# EAGLE design badge (EAGLE 9.6.2)
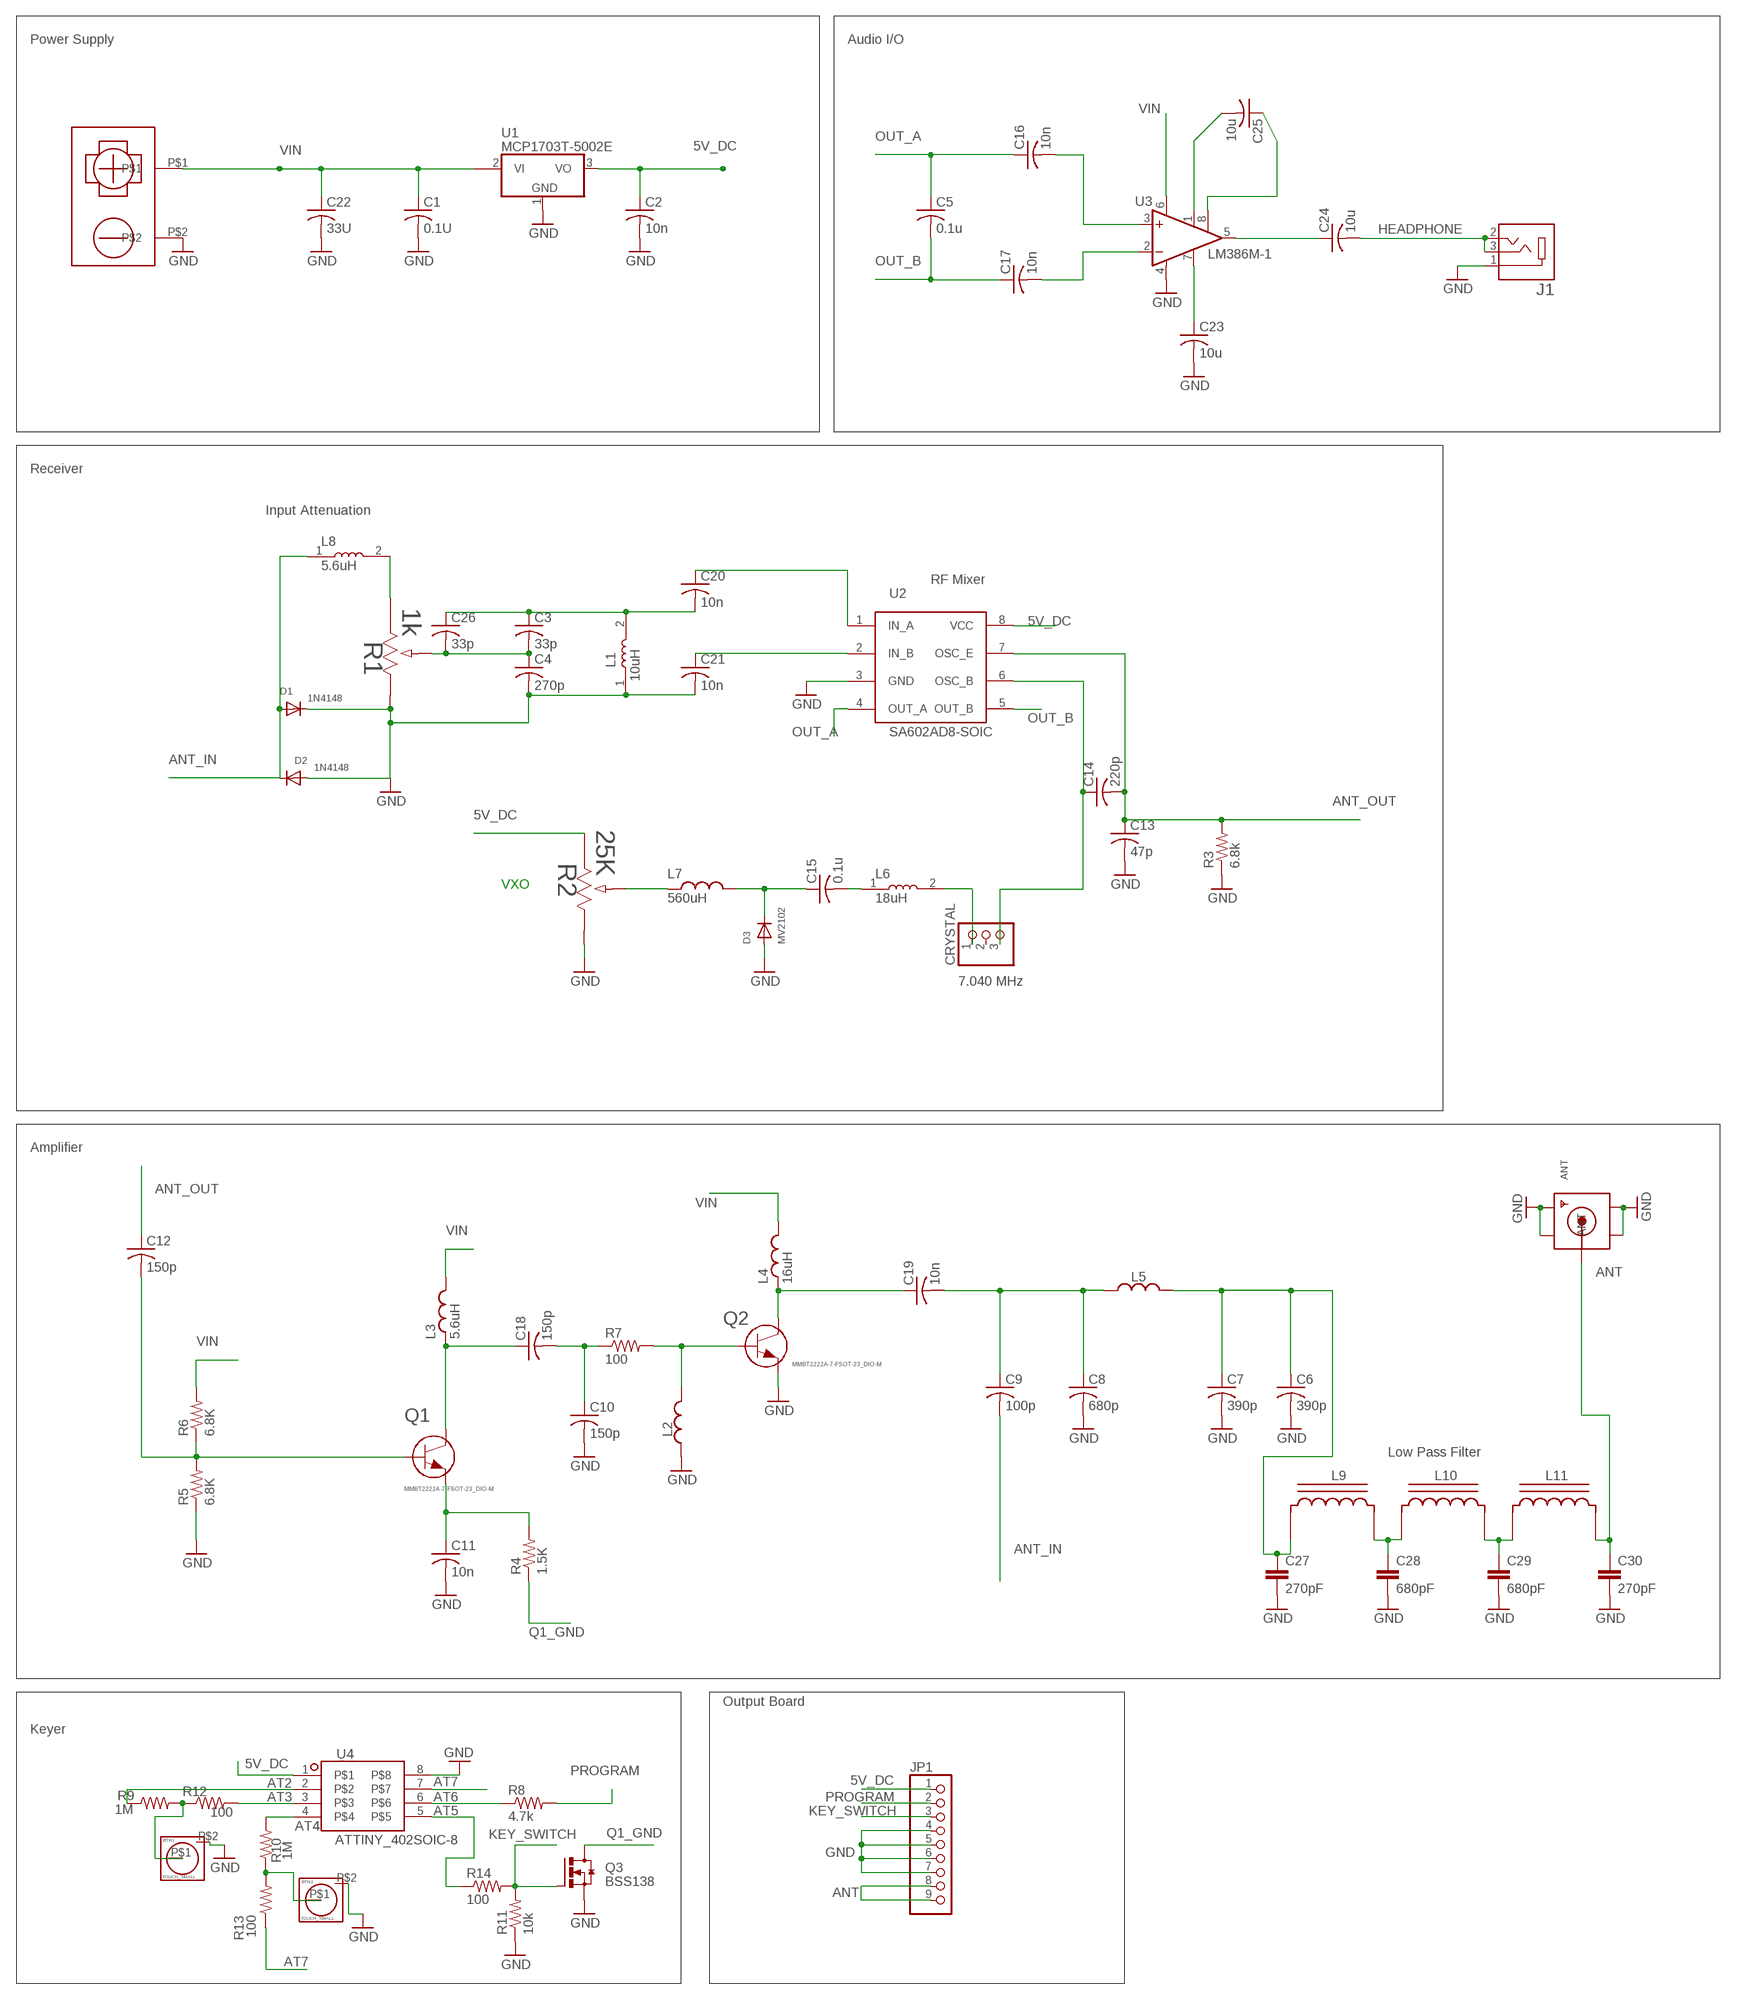
[diagram p0: schematic, sheet 1]

## Parts
ANT  SMACONNECTOR_EDGE  [SMA_EDGELAUNCH]
BTN1  TOUCH_SMALL  [TOUCH_SMALL]
BTN2  TOUCH_SMALL  [TOUCH_SMALL]
C1  0.1U  C-USC0805  [C0805]
C2  10n  C-USC0805  [C0805]
C3  33p  C-USC0805  [C0805]
C4  270p  C-USC0805  [C0805]
C5  0.1u  C-USC0805  [C0805]
C6  390p  C-USC0805  [C0805]
C7  390p  C-USC0805  [C0805]
C8  680p  C-USC0805  [C0805]
C9  100p  C-USC0805  [C0805]
C10  150p  C-USC0805  [C0805]
C11  10n  C-USC0805  [C0805]
C12  150p  C-USC0805  [C0805]
C13  47p  C-USC0805  [C0805]
C14  220p  C-USC0805  [C0805]
C15  0.1u  C-USC0805  [C0805]
C16  10n  C-USC0805  [C0805]
C17  10n  C-USC0805  [C0805]
C18  150p  C-USC0805  [C0805]
C19  10n  C-USC1206  [C1206]
C20  10n  C-USC0805  [C0805]
C21  10n  C-USC0805  [C0805]
C22  33U  C-USC1206  [C1206]
C23  10u  C-USC0805  [C0805]
C24  10u  C-USC0805  [C0805]
C25  10u  C-USC0805  [C0805]
C26  33p  C-USC0805  [C0805]
C27  270pF  1.0UF-1206-50V-10%  [1206]
C28  680pF  1.0UF-1206-50V-10%  [1206]
C29  680pF  1.0UF-1206-50V-10%  [1206]
C30  270pF  1.0UF-1206-50V-10%  [1206]
CRYSTAL  PINHD-1X3  [1X03]
D1  1N4148  DIODE_SOD-123FL  [SOD-123FL]
D2  1N4148  DIODE_SOD-123FL  [SOD-123FL]
D3  MV2102  DIODESOD-323F  [SOD-323F]
J1  SJ-3523-SMT-TR  [CUI_SJ-3523-SMT-TR]
JP1  PINHD-1X9  [1X09-BIG]
L1  10uH  MLF2012E5R6KT000  [INDC2012X87N]
L2  L_CHIP-1008(2520-METRIC)  [INDC2520X120N]
L3  5.6uH  SRP3012C-5R6M  [SRP3012C]
L4  16uH  ASPI-0630LR  [ASPI-0630LR]
L5  1.2uH  SRN4018TA-1R2M  [SRN4018TA]
L6  18uH  MLF2012E5R6KT000  [INDC2012X87N]
L7  560uH  LMOLDED-1812(4532-METRIC)  [INDM4532X32_W]
L8  5.6uH  MLF2012E5R6KT000  [INDC2012X87N]
L9  1.38uH  T37_INDUCTOR  [T37_INDUCTOR]
L10  1.67uH  T37_INDUCTOR  [T37_INDUCTOR]
L11  1.38uH  T37_INDUCTOR  [T37_INDUCTOR]
Q1  MMBT2222A-7-FSOT-23_DIO-M  [SOT-23_DIO-M]
Q2  MMBT2222A-7-FSOT-23_DIO-M  [SOT-23_DIO-M]
Q3  BSS138  [SOT23-3]
R1  1k  3362W-1-102LF  [POT_3362W]
R2  25K  3362W-1-102LF  [POT_3362W]
R3  6.8k  R-US_M0805  [M0805]
R4  1.5K  R-US_M0805  [M0805]
R5  6.8K  R-US_M0805  [M0805]
R6  6.8K  R-US_M0805  [M0805]
R7  100  R-US_M0805  [M0805]
R8  4.7k  R-US_M0805  [M0805]
R9  1M  R-US_M0805  [M0805]
R10  1M  R-US_M0805  [M0805]
R11  10k  R-US_M0805  [M0805]
R12  100  R-US_M0805  [M0805]
R13  100  R-US_M0805  [M0805]
R14  100  R-US_M0805  [M0805]
U1  MCP1703T-5002E  MCP170312MB  [SOT89]
U2  SA602AD8-SOIC  [SOIC127P599X175-8N]
U3  LM386M-1  [SO08]
U4  ATTINY_402SOIC-8  [SOIC127P599X175-8N]
U$1  9V_9689V_968_SMD  [9V_968_PAD]

## Nets
5V_DC [power]: C2.1 JP1.1 R2.1 U1.3(VO) U2.8(VCC) U4.1
ANT [power]: ANT.P(ANT) C30.1 JP1.8 JP1.9 L11.CA
ANT_IN: C9.2 D1.A D2.C L8.1
ANT_OUT: C12.1 C13.1 C14.2 R3.2 U2.7(OSC_E)
AT2: R9.1 U4.2
AT3: R12.2 U4.3
AT4: R10.2 U4.4
AT5: R14.1 U4.5
AT6: R8.1 U4.6
AT7: R13.1 U4.7
GND: ANT.GND@1(GND4) ANT.GND@3(GND2) BTN1.P$2 BTN2.P$2 C1.2 C2.2 C4.2 C6.2 C7.2 C8.2 C10.2 C11.2 C13.2 C21.2 C22.2 C23.2 C27.2 C28.2 C29.2 C30.2 D1.C D2.A D3.A J1.1 JP1.4 JP1.5 JP1.6 JP1.7 L1.1 L2.1 Q3.2(S) R1.3 R2.3 R3.1 R5.1 R11.1 U1.1(GND) U2.3(GND) U3.4(GND) U4.8 U$1.P$2
HEADPHONE: C24.2 J1.2 J1.3
KEY_SWITCH: JP1.3 Q3.1(G) R11.2 R14.2
N$1: ANT.GND@2(GND3)
N$2: ANT.GND@4(GND1)
N$3: C20.1 U2.1(IN_A)
N$4: C21.1 U2.2(IN_B)
N$5: C3.1 C20.2 C26.1 L1.2
N$6: C3.2 C4.1 C26.2 R1.2
N$7: L8.2 R1.1
N$8: C14.1 CRYSTAL.3 U2.6(OSC_B)
N$9: C16.2 U3.3(+IN)
N$10: C17.2 U3.2(-IN)
N$11: C23.1 U3.7(BYPASS)
N$12: C25.1 U3.8(GAIN)
N$13: C25.2 U3.1(GAIN)
N$14: C24.1 U3.5(OUT)
N$15: CRYSTAL.1 L6.2
N$16: C15.2 L6.1
N$17: C15.1 D3.C L7.2
N$18: L7.1 R2.2
N$19 [power]: C12.2 Q1.1 R5.2 R6.1
N$20 [power]: C11.1 Q1.2 R4.2
N$21 [power]: C18.1 L3.P$1 Q1.3
N$22 [power]: C10.1 C18.2 R7.1
N$23 [power]: L2.2 Q2.1 R7.2
N$24 [power]: C19.1 L4.P$1 Q2.3
N$25 [power]: C8.1 C9.1 C19.2 L5.P$1
N$26 [power]: C6.1 C7.1 C27.1 L5.P$2 L9.CB
N$27: BTN1.P$1 R9.2 R12.1
N$28 [power]: C28.1 L9.CA L10.CB
N$29 [power]: Q2.2 ; supply symbol labelled GND
N$30 [power]: C29.1 L10.CA L11.CB
N$31: BTN2.P$1 R10.1 R13.2
OUT_A: C5.1 C16.1 U2.4(OUT_A)
OUT_B: C5.2 C17.1 U2.5(OUT_B)
PROGRAM: JP1.2 R8.2
Q1_GND: Q3.3(D) R4.1
VIN [power]: C1.1 C22.1 L3.P$2 L4.P$2 R6.2 U1.2@1(VI1) U3.6(VS) U$1.P$1
Unconnected: CRYSTAL.2 U1.2(VI)

## Notes on the sheet
- Power Supply | Audio I/O
- Receiver
- Input Attenuation
- RF Mixer
- VXO
- 7.040 MHz
- Amplifier
- Low Pass Filter
- Output Board
- Keyer

## Library data of the parts
ANT = zort2:SMACONNECTOR: SMA Connector 90° DIP SMA Connector, 50 Ohm (4UConnector: 07259)
BTN1 BTN2 = zort2:TOUCH_SMALL: 10mm capacitive touch pad With ground hatch on top and bottom
C1-C26 = adafruit:C-US: CAPACITOR, American symbol
C27-C30 = SparkFun-Capacitors:1.0UF: 1µF ceramic capacitors A capacitor is a passive two-terminal electrical component used to store electrical energy temporarily in an electric field.; PROD_ID: CAP-09822; VALUE: 1.0uF
CRYSTAL = adafruit:PINHD-1X3: PIN HEADER
D1-D3 = adafruit:DIODE: Diode SMADIODE - SMA Surface Mount Package 20V 1A Schottky Diode Digikey: 641-1014-6-ND DO-1N4148 - Through Hole Small Current Diode SOD-123 20V 1 A (.5mV Vf) Schottky Diode - Digikey: MBRX120TPMSCT-ND SOD-323 10V 570mA (.38mV Vf, 3ns) Schottky Diode - Digikey: ZLLS410CT-ND SOD-523 30V 30mA Schottky Diode (RB751S-40TE61) - Digikey: RB751S-40TE61CT-ND SOT23-R/W - SOT23 Package (R = Solder Paste/Reflow Ovens, W = Hand-Soldering) BAT54Film 40V 300mA - Digikey: 497-7162-1-ND
J1 = SJ-3523-SMT-TR:SJ-3523-SMT-TR: Audio Jack Connector 3.5 mm Low Profile Surface Mount Stereo Jack, 3 Pin Right-Angle; MF: CUI Inc; STANDARD: Manufacturer recommendations
JP1 = adafruit:PINHD-1X9: Pin header 1x10 0.1" spacing With round pins
L1 L6 L8 = MLF2012E5R6KT000:MLF2012E5R6KT000: MLF Series 0805 5.6 uH ±10 % Tol. 15 mA Magnetic Shielded Multilayer Inductor; DESCRIPTION: Inductor RF Chip Shielded Multi-Layer 5.6uH 10% 4MHz 50Q-Factor Ferrite 15mA 600mOhm DCR 0805 T/R; MF: TDK; MP: MLF2012E5R6KT000; PACKAGE: 0805 TDK
L2 = zort2:L: Inductor Fixed - Generic; CATEGORY: Inductor; SUB-CATEGORY: Fixed
L3 = zort2:SRP3012C-5R6M: SRP3012C-5R6M SMD 1.5A 15uH inductor with a flat square package. DigiKey Link <https://www.digikey.com/en/products/detail/bourns-inc/SRP3012C-5R6M/11633310>.
L4 = zort2:ASPI-0630LR: ASPI-0630LR SMD inductors with flat square cases DigiKey Link <https://www.digikey.com/en/products/detail/abracon-llc/ASPI-0630LR-150M-T15/3059603>
L5 = zort2:SRN4018TA-1R2M: SRN4018TA-1R2M 1.2uH 3A inductor
L7 = zort2:L: Inductor Fixed - Generic
L9-L11 = toroid:T37_INDUCTOR: Inductor wound on a T37 Toroid
Q1 Q2 = zort2:MMBT2222A-7-F; BUILT_BY: EMA_UL_Team; MANUFACTURER_PART_NUMBER: MMBT2222A-7-F; SOURCELIBRARY: DIODESINC_2_2015-08-18; VENDOR: Diodes Inc
Q3 = Transistor:BSS138: MOSFET N-CH 50V 220MA SOT-23 Manufacturer's datasheet <https://www.onsemi.com/pub/Collateral/BSS138-D.PDF>; CREATED_BY: PCBLayout.com; DIGIKEY_PART_NUMBER: BSS138CT-ND; MANUFACTURER: ON Semiconductor; MPN: BSS138; PACKAGE: SOT-23
R1 R2 = zort2:3362W-1-102LF; BUILT_BY: EMA_UL_Team; MANUFACTURER_PART_NUMBER: 3362W-1-102LF; SOURCELIBRARY: Bourns_2012-08-08; VENDOR: Bourns Electronics
R3-R14 = adafruit:R-US_: RESISTOR, American symbol
U1 = linear:MCP1703*: 250 mA, 16V, Low Quiescent Current LDO Regulator Source: http://ww1.microchip.com/downloads/en/DeviceDoc/22049b.pdf
U2 = zort2:SA602AD
U3 = linear:LM386?-*: Low Voltage Audio Power Amplifier Source: http://cache.national.com/ds/LM/LM386.pdf
U4 = zort2:ATTINY_402
U$1 = zort2:9V_968: Keystone 968, 9V connector pad. https://www.digikey.com/product-detail/en/keystone-electronics/968/36-968-ND/151577

## Net classes
1 power: width 0.305 mm

## Board
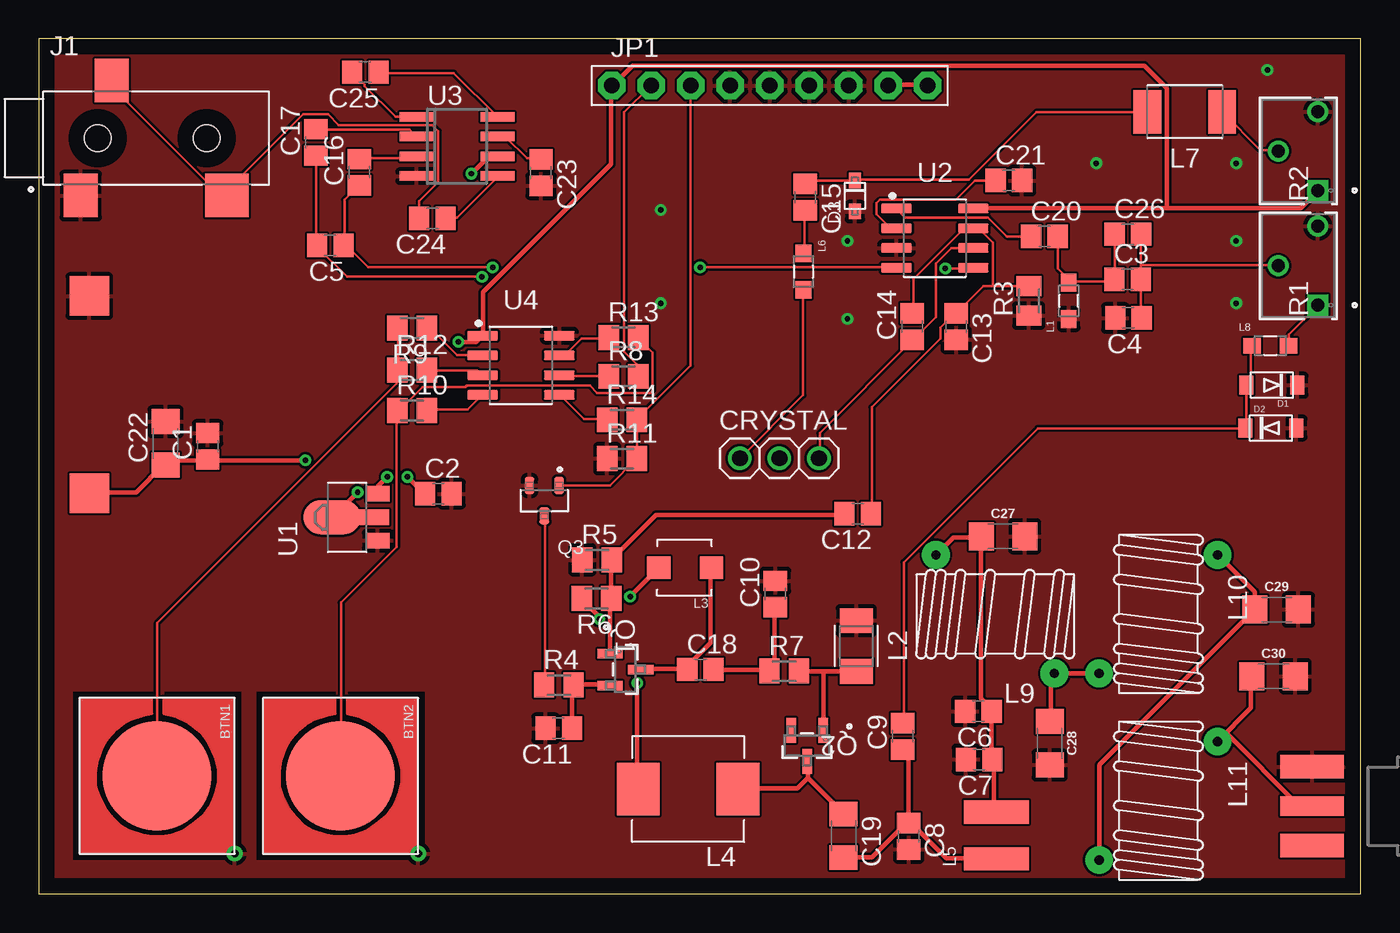
[diagram p1: board, top side]
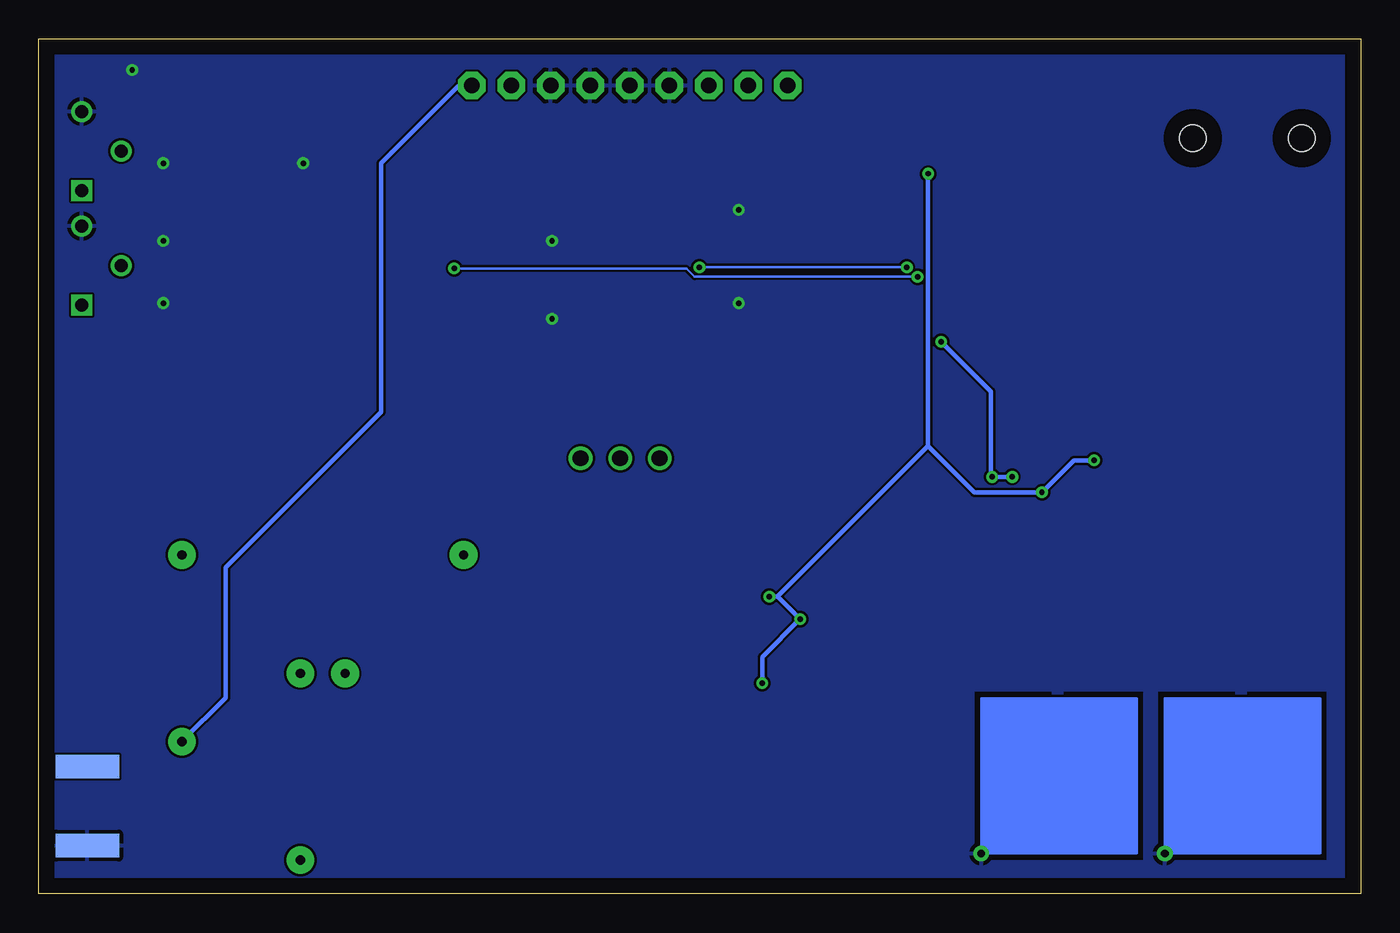
[diagram p2: board, bottom side, seen from below]

Size 85 x 55 mm. Coordinates in mm from the lower left corner, seen from the top.
Outline: 0,0 85,0 85,55 0,55 0,0
Copper layers (1*16): Top 0.035mm / dielectric 1.5mm / Bottom 0.035mm
Design rules "default": minimum track width 6mil, minimum drill 0.35mm, track to track 6mil, track to pad 6mil, pad to pad 6mil, via to via 6mil, smd to smd 6mil, copper to edge 40mil, drill to drill 6mil, minimum pad ring 10mil, minimum via ring 8mil, stop-mask expansion 4mil, vias tented up to drill 0mil, thermal gap 10mil

### Footprints (pad centres in the part's own frame; a part is rotated, then mirrored left to right if it is on the bottom)
SMA_EDGELAUNCH = smd 4.064 x 1.524: GND@1 2.032,-2.54; GND@2 2.032,2.54 | smd 4.064 x 1.524 bottom: GND@3 2.032,2.54; GND@4 2.032,-2.54 | smd 4.064 x 1.27: P 2.032,0
TOUCH_SMALL = smd 7 x 7: P$1 0,0 | drill 0.5 pad 1.016: P$2 5,5
C0805 = smd 1.3 x 1.5: 1 -0.85,0; 2 0.85,0
C1206 = smd 1.6 x 1.8: 1 -1.4,0; 2 1.4,0
1206 = smd 1.6 x 1.8: 1 -1.4,0; 2 1.4,0
1X03 = drill 1.016: 1 -2.54,0; 2 0,0; 3 2.54,0
SOD-123FL = smd 0.91 x 1.22: A 1.637,0; C -1.637,0
SOD-323F = smd 1 x 0.8: A -1,0; C 1,0
CUI_SJ-3523-SMT-TR = smd 2.2 x 2.8: 1 -1.1,-3.7; 3 0.9,3.7 | smd 2.8 x 2.8: 2 8.3,-3.7 | hole 1.7: 0,0; 7,0
1X09-BIG = drill 1.016 pad 1.778 octagon: 1 -10.16,0; 2 -7.62,0; 3 -5.08,0; 4 -2.54,0; 5 0,0; 6 2.54,0; 7 5.08,0; 8 7.62,0; 9 10.16,0
INDC2012X87N = smd 1.15 x 1: 1 -1.175,0; 2 1.175,0
INDC2520X120N = smd 1.587 x 2.129: 1 -1.633,0; 2 1.633,0
SRP3012C = smd 1.5 x 1.45: P$1 -1.7,0; P$2 1.7,0
ASPI-0630LR = smd 2.75 x 3.4: P$1 -3.2,0; P$2 3.2,0
SRN4018TA = smd 1.5 x 4.2: P$1 -1.5,0; P$2 1.5,0
INDM4532X32_W = smd 1.793 x 2.799: 1 -2.4,0; 2 2.4,0
T37_INDUCTOR = drill 0.6 pad 1.778: CA -3.81,-3.81; CB 3.81,3.81
SOT-23_DIO-M = smd 0.612 x 1.626: 1 -1.025,-0.996; 2 1.025,-0.996; 3 0,0.996
SOT23-3 = smd 0.62 x 1.1: 1 -0.95,-0.975; 2 0.95,-0.975; 3 0,0.975
POT_3362W = drill 0.838 pad 1.346 square: 1 0,0 | drill 0.838 pad 1.346: 2 2.54,2.54; 3 5.08,0
M0805 = smd 1.3 x 1.6: 1 -0.95,0; 2 0.95,0
SOT89 = smd 1 x 1.5: 1 -1.499,-1.981; 3 1.499,-1.981 | smd 1 x 2: 2 0,-1.727 | smd 2.2 x 3.7: 2@1 0,0.94
SOIC127P599X175-8N = smd 1.965 x 0.602: 1 -2.47,1.905; 2 -2.47,0.635; 3 -2.47,-0.635; 4 -2.47,-1.905; 5 2.47,-1.905; 6 2.47,-0.635; 7 2.47,0.635; 8 2.47,1.905
SO08 = smd 0.6 x 2.2: 1 -1.905,-2.6; 2 -0.635,-2.6; 3 0.635,-2.6; 4 1.905,-2.6; 5 1.905,2.6; 6 0.635,2.6; 7 -0.635,2.6; 8 -1.905,2.6
9V_968_PAD = smd 2.54 x 2.54: P$1 0,6.35; P$2 0,-6.35

### Placement (x,y rotation side)
ANT  83.91,5.65 180 top
BTN1  7.6,7.6 270 top
BTN2  19.4,7.6 270 top
C1  10.86,28.79 90 top
C2  25.69,25.74 0 top
C3  70.01,39.54 0 top
C4  70.07,37.05 180 top
C5  18.74,41.71 180 top
C6  60.42,11.75 180 top
C7  60.47,8.65 180 top
C8  55.94,3.71 270 top
C9  55.56,10.14 90 top
C10  47.36,19.29 90 top
C11  33.43,10.66 180 top
C12  52.66,24.46 180 top
C13  58.99,36.5 270 top
C14  56.16,36.49 90 top
C15  49.29,44.82 270 top
C16  20.61,46.42 90 top
C17  17.81,48.34 90 top
C18  42.54,14.44 0 top
C19  51.75,3.74 270 top
C20  64.66,42.29 0 top
C21  62.38,45.89 0 top
C22  8.15,28.98 90 top
C23  32.29,46.4 270 top
C24  25.31,43.46 180 top
C25  20.99,52.86 180 top
C26  70.03,42.44 0 top
C27  62,23 0 top
C28  65,9.7 270 top
C29  79.6,18.3 0 top
C30  79.4,14 0 top
CRYSTAL  47.62,28.02 0 top
D1  79.29,32.73 180 top
D2  79.23,29.97 0 top
D3  52.48,44.9 90 top
J1  3.79,48.62 0 top
JP1  47,52 0 top
L1  66.23,38.15 90 top
L2  52.57,15.95 270 top
L3  41.56,20.98 180 top
L4  41.75,6.75 180 top
L5  61.58,3.76 90 top
L6  49.17,40.03 270 top
L7  73.69,50.31 180 top
L8  79.19,35.27 0 top
L9  61.5,18 90 top
L10  72,18 180 top
L11  72,6 180 top
Q1  37.72,14.44 270 top
Q2  49.4,9.53 180 top
Q3  32.5,25.3 180 top
R1  82.25,37.87 90 top
R2  82.25,45.25 90 top
R3  63.66,38.15 90 top
R4  33.44,13.44 0 top
R5  35.89,21.49 0 top
R6  35.86,19.01 180 top
R7  47.93,14.34 0 top
R8  37.6,33.3 0 top
R9  24,36.4 180 top
R10  24,31.1 0 top
R11  37.5,28 0 top
R12  24,33.7 0 top
R13  37.6,35.8 0 top
R14  37.5,30.5 0 top
U1  19.81,24.23 90 top
U2  57.62,42.19 0 top
U3  26.89,48.08 270 top
U4  31,34 0 top
U$1  3.24,32.11 180 top

### Tracks (layer width: path | path; a pad name or v marks a point on that pad's centre or on a via)
5V_DC  (via drill 0.35)
  Top 0.305: 72.54,44.12 81.15,44.12 82.22,45.19 R2.1 | 72.54,44.12 60.12,44.12 U2.8 | v22.4,26.82 21.79,26.21 21.79,25.76 U1.3 | v23.7,26.82 24.77,25.76 C2.1 | v26.98,35.51 28.12,35.51 28.42,35.81 U4.1 28.57,35.97 28.57,38.71 36.8,46.94 36.8,51.97 JP1.1 36.96,52.05 38.18,53.26 71.09,53.26 72.54,51.82 72.54,44.12
  Bottom 0.305: v22.4,26.82 v23.7,26.82 23.77,26.9 23.77,32.31 v26.98,35.51
ANT
  Top 0.305: JP1.8 54.63,52.05 57.15,52.05 JP1.9 | C30.1 77.95,13.95 77.95,11.96 75.82,9.83 L11.CA 76.43,10.29 81,5.71 81.84,5.71 ANT.P
  Bottom 0.305: JP1.9 57.23,51.97 58.03,51.97 63,47 63,31 73,21 73,12.62 L11.CA 75.74,9.83
ANT_IN
  Top 0.152: L8.1 77.95,35.2 77.95,32.99 77.72,32.77 D1.A 77.65,32.69 77.65,30.02 D2.C 77.57,29.95 64.24,29.95 55.63,21.34 55.63,11.05 C9.2
ANT_OUT
  Top 0.152: C14.2 56.24,37.41 56.24,39.55 59.51,42.82 60.05,42.82 U2.7 60.12,42.82 60.43,42.82 61.34,41.91 61.34,39.09 | C12.1 53.57,24.46 53.57,31.32 57.99,35.74 57.99,36.42 58.98,37.41 C13.1 59.05,37.41 60.73,39.09 61.34,39.09 | 61.34,39.09 63.63,39.09 R3.2
AT2
  Top 0.152: R9.1 24.99,36.35 25.22,36.35 26.9,34.67 28.5,34.67 U4.2
AT3
  Top 0.152: R12.2 24.99,33.68 28.19,33.68 28.5,33.38 U4.3
AT4
  Top 0.152: R10.2 24.99,31.17 27.58,31.17 28.5,32.08 U4.4
AT5
  Top 0.152: R14.1 36.5,30.56 35.05,30.56 33.53,32.08 U4.5
AT6
  Top 0.152: R8.1 36.58,33.3 33.53,33.3 U4.6
AT7
  Top 0.152: R13.1 36.58,35.74 34.9,35.74 33.83,34.67 33.53,34.67 U4.7
GND  (via drill 0.35)
  other vias: 52,42 52,37 40,44 40,38 79,53 77,47 77,42 77,38 68,47
  pour Top: 0.3,54.7 0.3,0.3 84.7,0.3 84.7,54.7
  pour Bottom: 0.3,54.6 0.3,0.3 84.7,0.3 84.7,54.7 0.3,54.7
HEADPHONE
  Top 0.152: C24.2 24.46,43.51 24.46,44.58 25.68,45.8 25.68,49.07 25.3,49.45 19.28,49.45 18.59,50.14 16.99,50.14 12.12,45.26 12.12,44.96 J1.2 12.12,45.34 11.28,45.34 4.72,51.89 4.72,52.27 J1.3
KEY_SWITCH
  Top 0.152: Q3.1 36.73,26.29 38.41,27.96 R11.2 38.48,28.04 38.48,30.48 R14.2 38.48,30.56 41.91,33.98 41.91,51.97 JP1.3
N$3
  Top 0.152: C20.1 63.78,42.29 62.26,42.29 61.04,43.51 55.7,43.51 55.17,44.04 U2.1
N$4
  Top 0.152: C21.1 61.49,45.87 60.2,45.87 58.98,44.65 54.1,44.65 53.87,44.42 53.87,43.74 54.71,42.9 55.09,42.9 U2.2
N$5
  Top 0.152: C20.2 65.53,42.22 65.53,40.23 66.29,39.47 L1.2 66.29,39.4 69.04,39.4 69.11,39.47 C3.1 69.19,39.55 69.19,42.37 C26.1
N$6
  Top 0.152: C4.1 70.87,37.11 70.87,39.47 C3.2 70.87,40.46 | 70.87,40.46 70.87,42.37 C26.2 | 70.87,40.46 79.7,40.46 R1.2
N$7
  Top 0.152: L8.2 80.39,35.28 80.39,35.97 82.22,37.8 R1.1
N$8
  Top 0.152: U2.6 60.05,41.53 58.67,41.53 57.68,40.54 57.68,37.11 56.24,35.66 C14.1 56.16,35.59 50.22,29.64 50.22,28.04 CRYSTAL.3
N$9
  Top 0.152: C16.2 20.65,47.32 24.16,47.32 24.23,47.4 U3.3
N$10
  Top 0.152: C17.2 17.83,49.15 23.85,49.15 24.23,48.77 U3.2
N$11
  Top 0.152: C23.1 32.23,47.32 31.39,47.32 30.02,48.69 29.57,48.69 U3.7
N$12
  Top 0.152: C25.1 21.87,52.81 26.67,52.81 U3.8
N$13
  Top 0.152: C25.2 20.19,52.81 20.95,52.05 20.95,51.97 22.94,49.99 24.23,49.99 U3.1
N$14
  Top 0.152: C24.1 26.21,43.51 26.9,43.51 29.49,46.1 U3.5
N$15
  Top 0.152: L6.2 49.15,38.79 49.15,32.08 45.11,28.04 CRYSTAL.1
N$16
  Top 0.152: L6.1 49.23,41.22 49.23,43.97 C15.2
N$17
  Top 0.152: C15.1 49.3,45.72 49.45,45.87 52.43,45.87 D3.C 52.5,45.95 59.82,45.95 64.16,50.29 71.25,50.29 L7.2
N$18
  Top 0.152: R2.2 79.7,47.85 78.56,47.85 76.12,50.29 L7.1
N$19
  Top 0.305: C12.2 51.74,24.38 39.7,24.38 36.88,21.57 R5.2 36.8,21.34 36.8,19.05 R6.1 36.73,18.9 Q1.1
N$20
  Top 0.305: C11.1 34.29,13.34 34.37,13.41 R4.2 34.52,13.49 36.65,13.49 Q1.2
N$21
  Top 0.305: Q1.3 38.79,14.48 41.68,14.48 C18.1 41.68,14.63 43.2,16.15 43.2,20.95 L3.P$1
N$22
  Top 0.305: C18.2 43.43,14.4 46.94,14.4 R7.1 46.94,14.55 47.32,14.94 47.32,18.36 C10.1
N$23
  Top 0.305: 50.44,14.33 52.5,14.33 L2.2 | 50.44,14.33 48.92,14.33 R7.2 | 50.44,14.33 50.44,10.59 Q2.1
N$24
  Top 0.305: 49.45,7.47 49.45,8.46 Q2.3 | 49.45,7.47 51.74,5.18 C19.1 | 49.45,7.47 48.77,6.78 44.96,6.78 L4.P$1
N$25
  Top 0.305: C8.1 55.93,4.57 55.93,8.91 55.63,9.22 C9.1 | C19.2 51.82,2.36 53.57,2.36 55.78,4.57 C8.1 | L5.P$1 61.57,2.29 58.37,2.29 56.08,4.57 C8.1
N$26
  Top 0.305: L9.CB 57.76,21.87 58.83,22.94 60.58,22.94 C27.1 60.58,22.78 60.58,12.57 61.27,11.89 C6.1 61.27,11.73 61.27,8.69 C7.1 61.42,8.53 61.42,5.49 61.57,5.33 L5.P$2
N$27
  Top 0.152: R9.2 23.09,36.35 23.09,33.76 R12.1 23.01,33.68 23.01,32.84 7.62,17.45 7.62,7.62 BTN1.P$1
N$28
  Top 0.305: C28.1 65.08,11.12 65.08,13.95 65.3,14.17 L9.CA 65.46,14.17 68.12,14.17 L10.CB
N$30
  Top 0.305: L10.CA 75.82,21.79 78.18,19.43 78.18,18.36 C29.1 78.11,18.21 68.2,8.31 68.2,2.21 L11.CB
N$31
  Top 0.152: R13.2 38.56,35.74 39.47,34.82 39.47,32.38 39.32,32.23 35.89,32.23 35.43,32.69 27.51,32.69 27.43,32.61 24.69,32.61 23.24,31.17 23.09,31.17 R10.1 23.01,31.09 23.01,22.33 19.43,18.75 19.43,7.62 BTN2.P$1
OUT_A  (via drill 0.35)
  Top 0.152: C16.1 20.57,45.57 19.66,44.65 19.66,41.76 C5.1 19.74,41.76 21.18,40.31 v29.18,40.31 | v42.52,40.31 55.09,40.31 U2.4
  Bottom 0.152: v29.18,40.31 v42.52,40.31
OUT_B  (via drill 0.35)
  Top 0.152: C17.1 17.83,47.47 17.83,41.76 C5.2 17.83,41.68 19.81,39.7 v28.5,39.7 | v58.29,40.23 60.05,40.23 U2.5
  Bottom 0.152: v58.29,40.23 43.36,40.23 42.82,39.7 v28.5,39.7
PROGRAM
  Top 0.152: R8.2 38.48,33.38 38.48,34.06 37.64,34.9 37.64,50.29 39.32,51.97 JP1.2
Q1_GND
  Top 0.152: Q3.3 32.54,24.31 32.54,13.49 R4.1
VIN  (via drill 0.35)
  Top 0.305: U$1.P$1 3.28,25.83 6.25,25.83 8,27.58 C22.1 8.46,27.89 10.82,27.89 C1.1 10.97,27.89 v17.14,27.89 | v38.02,19.13 39.85,20.95 L3.P$2 | v36.04,17.68 36.04,17.83 34.9,18.97 R6.2 | v27.81,46.33 28.88,47.4 29.49,47.4 U3.6 | v38.48,13.56 38.48,6.78 L4.P$2 | v20.5,25.83 18.9,24.23 U1.2@1
  Bottom 0.305: 37.49,19.13 v38.02,19.13 | 37.49,19.13 v36.04,17.68 38.48,15.24 v38.48,13.56 | 27.81,28.8 v27.81,46.33 | 37.49,19.13 27.81,28.8 | 27.81,28.8 24.84,25.83 v20.5,25.83 18.44,27.89 v17.14,27.89